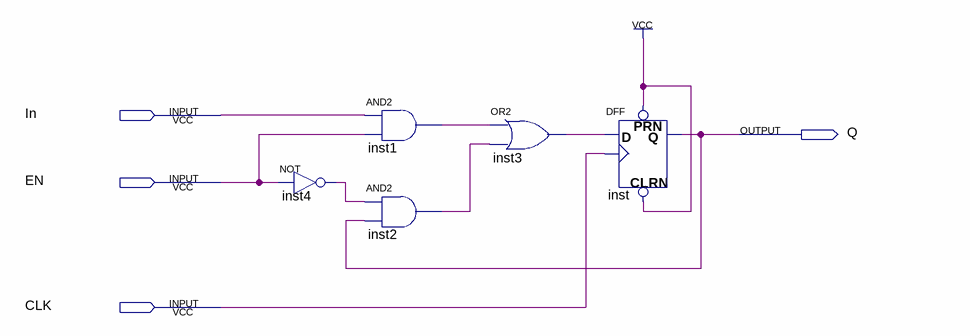
[diagram p0: schematic sheet]
// Quartus schematic RFC.bdf as structural Verilog: 5 symbols, 4 pins
module RFC (
  input  In,
  input  EN,
  input  CLK,
  output Q
);

  wire inst1_out, inst2_out, inst3_out, inst4_out;

  not inst4 (inst4_out, EN);
  and inst1 (inst1_out, In, EN);
  and inst2 (inst2_out, inst4_out, Q);
  or inst3 (inst3_out, inst1_out, inst2_out);
  DFF inst (.CLRN(1'b1), .CLK(CLK), .D(inst3_out), .PRN(1'b1), .Q(Q));
endmodule
